# Altium schematic sheet MB.SchDoc
size A3; SheetNumber: 4; SheetTotal: 14
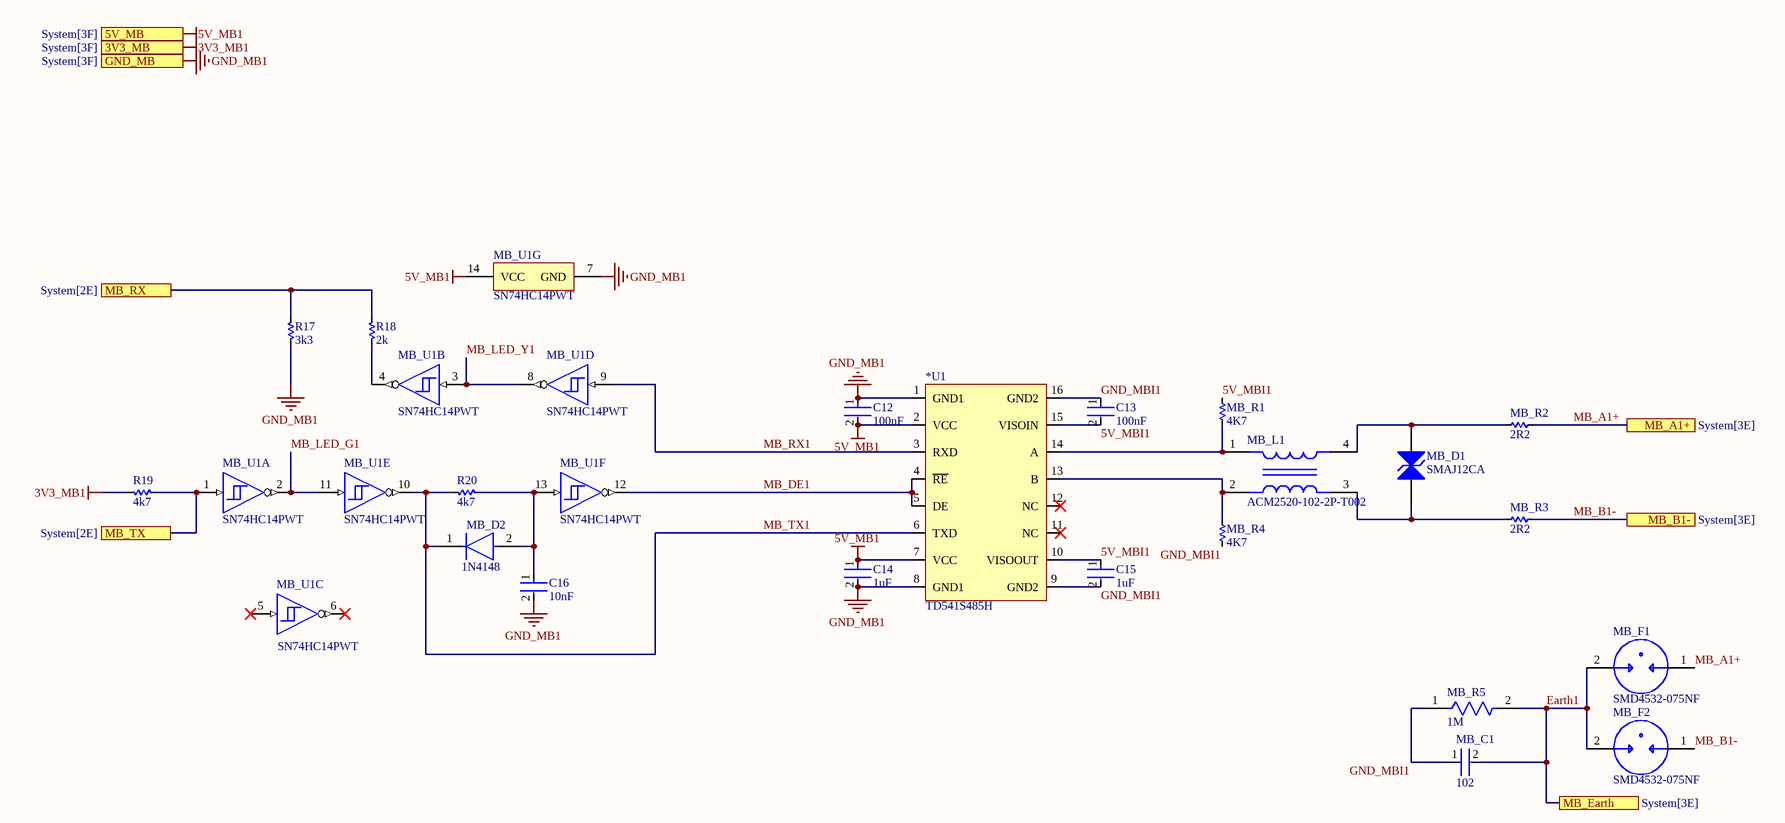
[diagram p0: MB.SchDoc]

## Parts
*U1  TD541S485H  [TD(H)541S485H]
C12  100nF  [FP-GRM21B-0_15-MFG]
C13  100nF  [FP-GRM21B-0_15-MFG]
C14  1uF  [FP-GRM21B-0_15-MFG]
C15  1uF  [FP-GRM21B-0_15-MFG]
C16  10nF  [FP-GRM21B-0_15-MFG]
MB_C1  102  [FP-GRM32-0_3-MFG]
MB_D1  SMAJ12CA  [VISH-DO-214AC-2_N]
MB_D2  1N4148  [FP-DO-213AA-MFG]
MB_F1  SMD4532-075NF  [FP-SG-MFG]
MB_F2  SMD4532-075NF  [FP-SG-MFG]
MB_L1  ACM2520-102-2P-T002  [FP-ACM2520-2P-MFG]
MB_R1  4K7  [RES-SMD-0805]
MB_R2  2R2  [RES-SMD-0805]
MB_R3  2R2  [RES-SMD-0805]
MB_R4  4K7  [RES-SMD-0805]
MB_R5  1M  [FP-RC1206-MFG]
MB_U1  SN74HC14PWT  [PW0014A_M]  (parts A,B,C,D,E,F,G of 7)
R17  3k3  [RES-SMD-0603]
R18  2k  [RES-SMD-0603]
R19  4k7  [RES-SMD-0603]
R20  4k7  [RES-SMD-0603]

## Ports
3V3_MB (see System[3F]), 5V_MB (see System[3F]), GND_MB (see System[3F]), MB_A1+ (see System[3E]), MB_B1- (see System[3E]), MB_Earth (see System[3E]), MB_RX (see System[2E]), MB_TX (see System[2E])

## Nets
3V3_MB1: R19.2 ; port 3V3_MB
5V_MB1: *U1.2(VCC) *U1.7(VCC) C12.2 C14.1 MB_U1.14(VCC) ; port 5V_MB
GND_MB1: *U1.1(GND1) *U1.8(GND1) C12.1 C14.2 C16.2 MB_U1.7(GND) R17.1 ; port GND_MB
5V_MBI1: *U1.10(VISOOUT) *U1.15(VISOIN) C13.2 C15.1 MB_R1.2
Earth1: MB_C1.2 MB_F1.2 MB_F2.2 MB_R5.2 ; port MB_Earth
GND_MBI1: *U1.9(GND2) *U1.16(GND2) C13.1 C15.2 MB_C1.1 MB_R4.1 MB_R5.1
MB_A1+: MB_F1.1 MB_R2.1 ; port MB_A1+
MB_B1-: MB_F2.1 MB_R3.1 ; port MB_B1-
MB_DE1: *U1.4(~{RE}) *U1.5(DE) MB_U1.12(~{6Y})
MB_LED_G1: MB_U1.2(~{1Y}) MB_U1.11(5A)
MB_LED_Y1: MB_U1.3(2A) MB_U1.8(~{4Y})
MB_RX: R17.2 R18.2 ; port MB_RX
MB_RX1: *U1.3(RXD) MB_U1.9(4A)
MB_TX: MB_U1.1(1A) R19.1 ; port MB_TX
MB_TX1: *U1.6(TXD) MB_D2.1(C) MB_U1.10(~{5Y}) R20.2
Net*U1_13: *U1.13(B) MB_L1.2 MB_R4.2
Net*U1_14: *U1.14(A) MB_L1.1 MB_R1.1
NetC16_1: C16.1 MB_D2.2(A) MB_U1.13(6A) R20.1
NetMB_D1_1: MB_D1.1(A1) MB_L1.3 MB_R3.2
NetMB_D1_2: MB_D1.2(A2) MB_L1.4 MB_R2.2
NetMB_U1_4: MB_U1.4(~{2Y}) R18.1

Not connected (* = marked no-connect by the designer): *U1 11(NC)* 12(NC)*; MB_U1 5(3A)* 6(~{3Y})*

## Library data of the parts
*U1 = TD(H)541S485H: TD541S485H IC Transceiver RS-485/RS-422 DFN-16
C12-C16 = CMP-2007-03385-2: Cap 0805 10%; Material: Ceramic; Voltage: 6.3V; Dielectric: X5R; Tolerance: 20%; Capacitance: 22uF; Max Operating Temperature: 85°C; Min Operating Temperature: -55°C; Case/Package: 0805; Thickness: 0.053inch; Packaging: Tape and Reel; Depth: 1.25mm; Termination: SMD/SMT; Voltage Rating (DC): 6.3V; Radiation Hardening: No; Mount: Surface Mount; Lead Free: Lead Free; Package Quantity: 1; REACH SVHC: No SVHC; Voltage Rating: 6.3V; Length: 2mm; Case Code (Imperial): 0805; Case Code (Metric): 2012; Width: 0.049inch; Height: 1.25mm
MB_C1 = CMP-2000-05259-2: Tụ 1nF 1210 2000V 10%; 3DS Part Number: 220-00002; Manufacturer Part Number: GRM32ER60J107ME20L; Manufacturer: Murata; Voltage: 6.3V; Temperature Characteristic: X5R; Temperature Coefficient: 15%; Capacitance: 100uF; Value: 100uF; Tolerance: 20%; Octopart: https://octopart.com/grm32er60j107me20l-murata-197007; ComponentLink2URL: https://search.murata.co.jp/Ceramy/image/img/A01X/G101/ENG/GRM32ER60J107ME20-01.pdf; Temperature Range High: +85°C; RoHS: TRUE; Device Class L3: Ceramic Capacitors; Device Class L2: Capacitors; Package: GRM32-0.3; Voltage Rating: 6.3V; Category: Cap; Device Class L1: Passive Components; Automotive: No; Digikey Description: CAP CER 100UF 6.3V X5R 1210; Temperature: -55°C to +85°C; Height: 2.7mm; Ipc Land Pattern Name: CAPC320250X250; Material: Ceramic; Temperature Range Low: -55°C; Lead Free: Yes; ComponentLink2Description: Datasheet
MB_D1 = CMP-0548-00198-4: SMAJ12CA TVS DIODE 12VWM 19.9VC DO214AC; Manufacturer: Vishay Semiconductor; PartNumber: SMAJ8.5CA-E3/61; VBR Bi-Directional (V): 6.4 to 231; VWM (V): 8.5; ID (uA): 20; Packing: Tape and Reel; PPPM (W): 400, 300; IFSM: 40 A; DatasheetVersion: 12/8/2013; ComponentLink3URL: http://www.vishay.com/docs/88390/smaj50a.pdf; ComponentLink2Description: Datasheet; PackageReference: DO-214AC-2; PackageDescription: 2-Pin DO-214AC (SMA), Body 4.245 x 2.665 mm; RoHS: TRUE; Mounting Technology: Surface Mount; ComponentLink3Description: Package Specification; ComponentLink1Description: Manufacturer URL; Operating Junction and Storage Temperature Range: -55 to 150 degC; ComponentLink2URL: http://www.vishay.com/docs/88390/smaj50a.pdf; ComponentLink1URL: http://www.vishay.com/
MB_D2 = CMP-2000-07607-2: 1N4148 LL4148 SOD-80/1206 SMD; Manufacturer Part Number: JANTX1N4148UR-1; Manufacturer: Microsemi; Max Junction Temp: +175°C; Max Repetitive Reverse Voltage: 75V; Value: 4pF; Reverse Voltage: 100V; Forward Current: 200mA; Max Surge Forward Current: 2A; Temperature: -65°C to +175°C; Device Class L2: Diodes; Capacitance: 4pF; Octopart: https://octopart.com/jantx1n4148ur-1-microsemi-6804654; Height: 1.7mm; Automotive: No; Digikey Description: DIODE GEN PURP 75V 200MA DO213AA; Device Class L1: Discrete Semiconductors; Package: DO-213AA; Category: Diode; ComponentLink2URL: https://www.microsemi.com/document-portal/doc_download/125215-lds-0281-1-datasheet; Device Class L3: Rectifier Diodes; Temperature Range Low: -65°C; Temperature Range High: +175°C; Mouser Description: Diodes - General Purpose, Power, Switching Switching; RoHS: FALSE; Lead Free: No; ComponentLink2Description: Datasheet
MB_F1 MB_F2 = CMP-08601-000002-1: Fail Short: No; Number of Terminals/Pins: 2; REACH SVHC: No SVHC; Case Code (Imperial): 1812; Case/Package: 1812; Mount: Surface Mount; RoHS Compliant: Yes; Number of Pins: 2; Package Quantity: 2000; Length: 4.5mm; Number of Poles: 2; Min Operating Temperature: -40°C; Case Code (Metric): 4532; Max Operating Temperature: 90°C; Depth: 3.2mm; Termination: SMD/SMT; Packaging: Tape and Reel; Series: SG
MB_L1 = CMP-08256-000012-1: ACM2520-102-2P-T002 CMC 200MA 2LN 1KOHM SMD; DC Resistance-Max: 350mR; Number of Lines: 2; Current Rating: 400mA; Impedance: 300R; Voltage Rating: 20V; Test Frequency: 100MHz; Series: ACM; Termination: SMD/SMT; Width: 0.079inch; Mount: Surface Mount; DC Resistance (DCR): 350mR; Lead Free: Lead Free; Max DC Current: 400mA; Package Quantity: 1; REACH SVHC: No SVHC; Min Operating Temperature: -40°C; Packaging: Tape and Reel; Max Operating Temperature: 85°C; Height: 0.051inch; Case/Package: 1008; Length: 0.098inch; RoHS Compliant: Yes; Current: 400mA
MB_R1-MB_R4 = Res-SMD: Res 0805 5%; Manufacturer: Generic Components; Class: Passive; Published: 08/06/2000; Publisher: Altium Hobart Technology Centre
MB_R5 = CMP-2100-03681-2: RES SMD 1/4W 1206; Manufacturer Part Number: RC1206JR-070RL; Manufacturer: YAGEO; Voltage Rating: 200V; Temperature Coefficient: 300ppm/°C; Power Rating: 0.25W; Value: 0Ω; Tolerance: 5%; Temperature Range Low: -55°C; Category: Res; Automotive: No; Ipc Land Pattern Name: RESC310160X55; Device Class L1: Passive Components; Temperature: -55°C to +155°C; ComponentLink2URL: https://www.yageo.com/upload/media/product/productsearch/datasheet/rchip/PYu-RC_Group_51_RoHS_L_10.pdf; Lead Free: Yes; Height: 0.65mm; Footprint Url: https://www.yageo.com/upload/website/yageo_PYu-R_Mount_10_19050818_343.pdf; Package: RC1206; Digikey Description: RES SMD 0 OHM JUMPER 1/4W 1206; Temperature Range High: +155°C; Device Class L3: Chip SMD Resistors; Device Class L2: Resistors; Octopart: https://octopart.com/rc1206jr-070rl-yageo-40025601; Resistance: 0Ω; Series: RC; ComponentLink2Description: Datasheet; Composition: Thick Film; RoHS: TRUE; Mouser Description: Resistor: thick film; SMD; 1206; 0O; 0.25W; ±5%; -55÷155°C
MB_U1 = CMP-1615-00108-4: Hex Schmitt-Trigger Inverters, PW0014A, SMALL T&R; Manufacturer: Texas Instruments; F @ Nom Voltage(Max)(Mhz): 20; Input Type: CMOS; VCC(Min)(V): 2; Bits(#): 6; Output Drive (IOL/IOH)(Max)(mA): -4/4; Technology Family: HC; Rating: Catalog; Voltage(Nom)(V): 5; ICC @ Nom Voltage(Max)(mA): 0.02; Schmitt Trigger: Yes; tpd @ Nom Voltage(Max)(ns): 31; Operating Temperature Range(C): -40 to 85; Output Type: CMOS; DatasheetVersion: SCLS085G; Generic Part Number: SN74HC14; VCC(Max)(V): 6; Code_JEDEC: MO-153; PackageReference: PW0014A
R17-R20 = Res-SMD: Res 0603 5%; Manufacturer: Generic Components; Class: Passive; Published: 08/06/2000; Publisher: Altium Hobart Technology Centre